# Altium schematic sheet torque.SchDoc
size A4
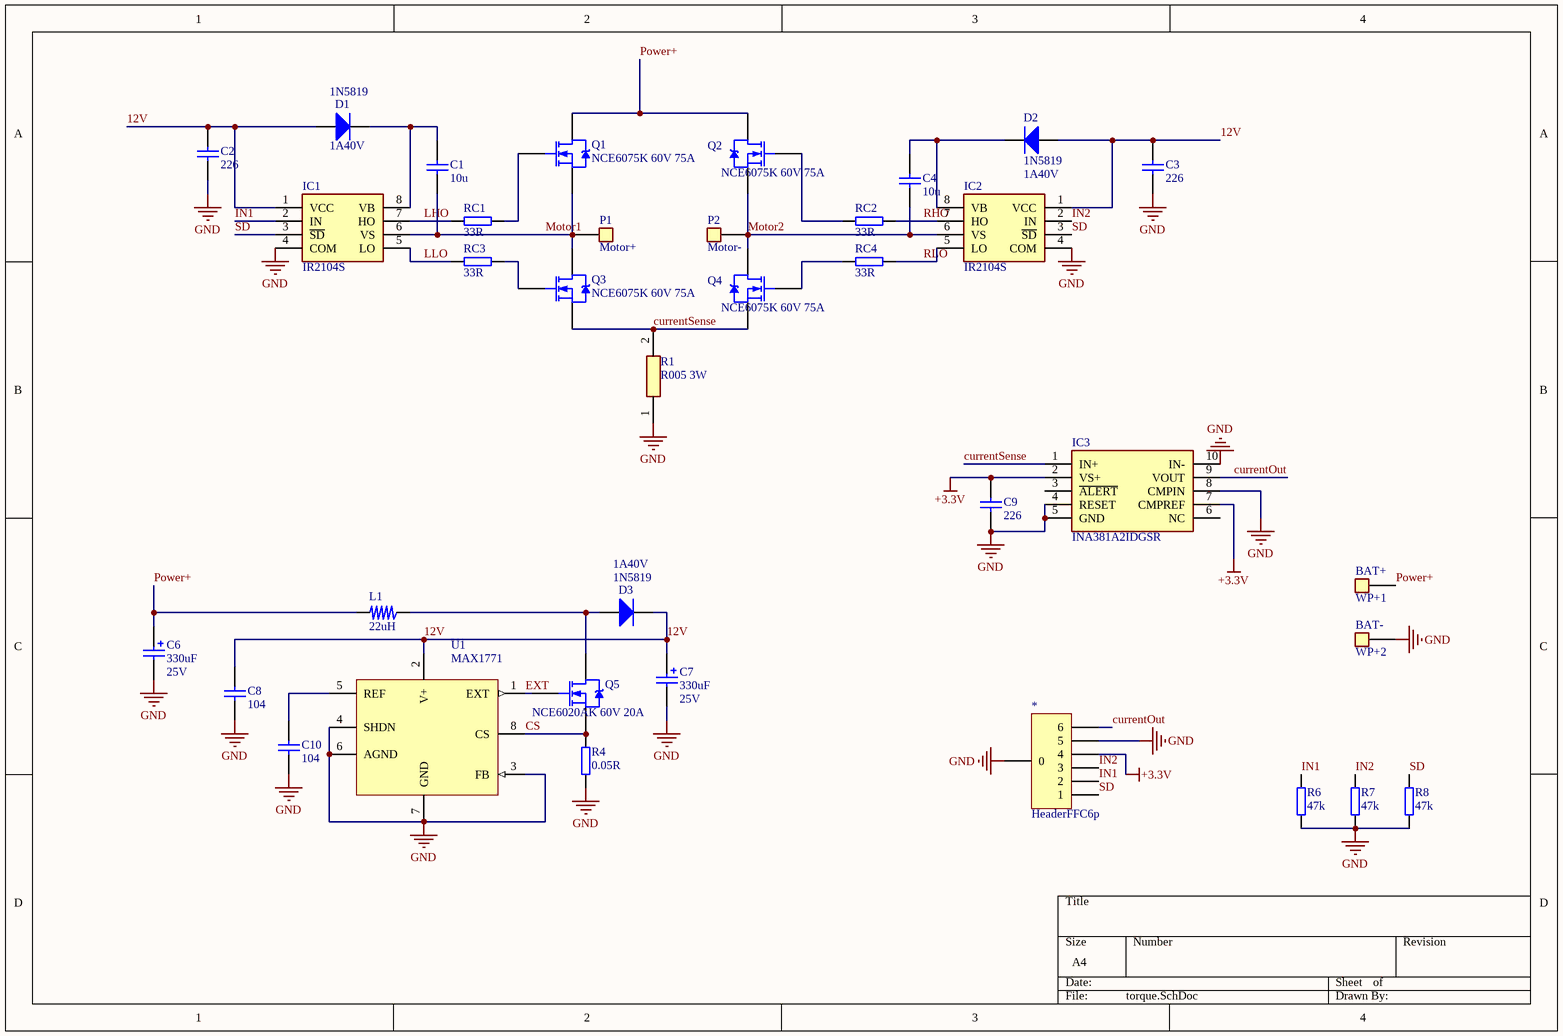
[diagram p0: torque.SchDoc]

## Parts
*  HeaderFFC6p  [FH12-6S-1.0SH]
C1  10u  [CAPC3216[1206]]
C2  226  [CAPC1608[0603]]
C3  226  [CAPC1608[0603]]
C4  10u  [CAPC3216[1206]]
C6  Voltage: 25V  [CAPS8]  (hidden comment: 330uF)
C7  Voltage: 25V  [CAPS8]  (hidden comment: 330uF)
C8  104  [CAPC1608[0603]]
C9  226  [CAPC1608[0603]]
C10  104  [CAPC1608[0603]]
D1  Voltage: 1A40V  [SOD-323]  (hidden comment: 1N5819)
D2  Voltage: 1A40V  [SOD-323]  (hidden comment: 1N5819)
D3  Voltage: 1A40V  [SOD-323]  (hidden comment: 1N5819)
IC1  IR2104S  [SOIC127P600X175-8N]
IC2  IR2104S  [SOIC127P600X175-8N]
IC3  INA381A2IDGSR  [SOP50P490X110-10N]
L1  22uH  [WHC0630]
P1  Motor+  [WirePadSingleSide]  (no BOM)
P2  Motor-  [WirePadSingleSide]  (no BOM)
Q1  NCE6075K 60V 75A  [TO-252]
Q2  NCE6075K 60V 75A  [TO-252]
Q3  NCE6075K 60V 75A  [TO-252]
Q4  NCE6075K 60V 75A  [TO-252]
Q5  NCE6020AK 60V 20A  [TO-252]
R1  R005 3W  [R2512]
R4  value 0.05R  [RESC3225[1210]]  (hidden comment: 0.05)
R6  47k  [RESC1608[0603]]
R7  47k  [RESC1608[0603]]
R8  47k  [RESC1608[0603]]
RC1  33R  [RESC1608[0603]]
RC2  33R  [RESC1608[0603]]
RC3  33R  [RESC1608[0603]]
RC4  33R  [RESC1608[0603]]
U1  MAX1771  [SOIC8]
WP+1  BAT+  [WirePadSingleSide]  (no BOM)
WP+2  BAT-  [WirePadSingleSide]  (no BOM)

## Nets
+3.3V: *.4 C9.1 IC3.2(VS+) IC3.7(CMPREF)
GND: *.0 *.5 C2.2 C3.2 C6.2 C7.2 C8.2 C9.2 C10.1 IC1.4(COM) IC2.4(COM) IC3.4(RESET) IC3.5(GND) IC3.8(CMPIN) IC3.10(IN-) R1.1 R4.2 R6.1 R7.1 R8.1 U1.3(FB) U1.4(SHDN) U1.6(AGND) U1.7(GND) WP+2.1
12V: C2.1 C3.1 C7.1 C8.1 D1.A D2.A D3.K IC1.1(VCC) IC2.1(VCC) U1.2(V+)
CS: Q5.3(S) R4.1 U1.8(CS)
currentOut: *.6 IC3.9(VOUT)
currentSense: IC3.1(IN+) Q3.3(S) Q4.3(S) R1.2
EXT: Q5.1(G) U1.1(EXT)
IN1: *.2 IC1.2(IN) R6.2
IN2: *.3 IC2.2(IN) R7.2
LHO: IC1.7(HO) RC1.1
LLO: IC1.5(LO) RC3.1
Motor1: C1.2 IC1.6(VS) P1.1 Q1.3(S) Q3.2(D)
Motor2: C4.2 IC2.6(VS) P2.1 Q2.3(S) Q4.2(D)
Power+: C6.1 L1.2 Q1.2(D) Q2.2(D) WP+1.1
RHO: IC2.7(HO) RC2.1
RLO: IC2.5(LO) RC4.1
SD: *.1 IC1.3(~{SD}) IC2.3(~{SD}) R8.2
NetC1_1: C1.1 D1.K IC1.8(VB)
NetC4_1: C4.1 D2.K IC2.8(VB)
NetC10_2: C10.2 U1.5(REF)
NetD3_A: D3.A L1.1 Q5.2(D)
NetQ1_1: Q1.1(G) RC1.2
NetQ2_1: Q2.1(G) RC2.2
NetQ3_1: Q3.1(G) RC3.2
NetQ4_1: Q4.1(G) RC4.2

Not connected (* = marked no-connect by the designer): IC3 3(~{ALERT}) 6(NC)

## Library data of the parts
C1-C4 C8-C10 = Cap Chip 1: Chip Capacitor, PSpice Model; Tolerance: Y5V; Voltage: 3V; Published: 8-Jun-2000; Revision: July-2002: Re-released for DXP Platform.; Publisher: Altium Limited; Price(RMB): 0.000
  C1 C4: Value: 10u
  C2 C3 C9: Value: 226
  C8 C10: Value: 104
C6 C7 = Cap Solid: Polarized Capacitor (Radial); Published: 8-Jun-2000; Revision: July-2002: Re-released for DXP Platform.; Publisher: Altium Limited; Price(RMB): 0.000; Value: 330uF
D1-D3 = Diode SOD: MELF Diode; Imax: 500mA; Published: 8-Jun-2000; Revision: July-2002: Re-released for DXP Platform.; Publisher: Altium Limited; Price(RMB): 0.000; PartNumber: 1N5819
IC1 IC2 = IR2104S: Integrated Circuit; Manufacturer_Name: Infineon; Datasheet Link: http://www.infineon.com/dgdl/ir2104.pdf?fileId=5546d462533600a4015355c7c1c31671; Height: 1.75mm; Manufacturer_Part_Number: IR2104S
IC3 = INA381A1IDGSR: Integrated Circuit; Manufacturer_Name: Texas Instruments; Datasheet Link: https://www.ti.com/lit/gpn/INA381; Height: 1.1mm; Manufacturer_Part_Number: INA381A1IDGSR; Mouser Part Number: 595-INA381A1IDGSR; Mouser Price/Stock: https://www.mouser.co.uk/ProductDetail/Texas-Instruments/INA381A1IDGSR?qs=rkhjVJ6%2F3EJisYwyX9Ekgg%3D%3D; Arrow Part Number: INA381A1IDGSR; Arrow Price/Stock: https://www.arrow.com/en/products/ina381a1idgsr/texas-instruments?region=nac
L1 = L
P1 P2 WP+1 WP+2 = Wire Pad: Wire soldering pad.; Price(RMB): 0.000
Q1-Q5 = NMOS
R1 = CR2512: Resistor; Manufacturer_Name: Bourns; Manufacturer_Part_Number: CR2512-F/-1R00ELF; Height: 0.75mm; Mouser Part Number: 652-CR2512-F/1R00ELF; Mouser Price/Stock: https://www.mouser.co.uk/ProductDetail/Bourns/CR2512-F-1R00ELF?qs=W%2FMpXkg%252BdQ6b1PcPiGLK9Q%3D%3D
R4 R6-R8 RC1-RC4 = Res Chip 2p 1: Chip Resistor, PSpice Model, IPC PCB Library Drawing; Tolerance: 5%; TC1: 0; Published: 8-Jun-2000; Revision: July-2002: Re-released for DXP Platform.; Publisher: Altium Limited; Price(RMB): 0.000; TC2: 0
  R6-R8: Value: 47k
  RC1-RC4: Value: 33R
U1 = MAX1771: DC-to-DC Converter Control Circuit; Price(RMB): 0.0; PartNumber: MAX1771